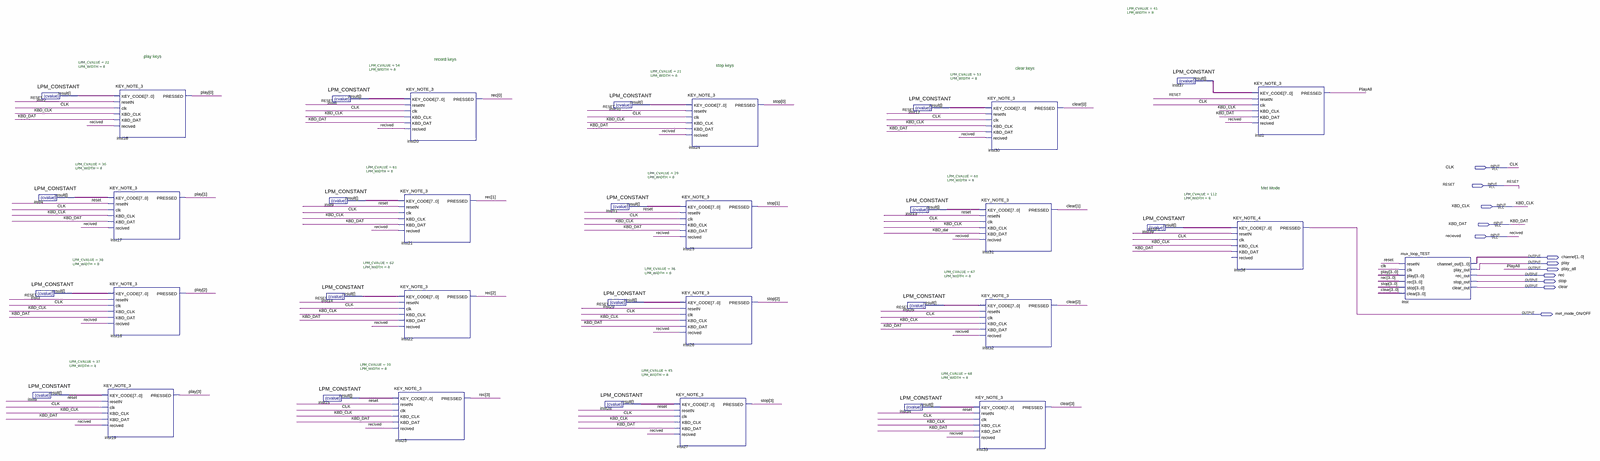
[diagram p0: schematic sheet, whole]
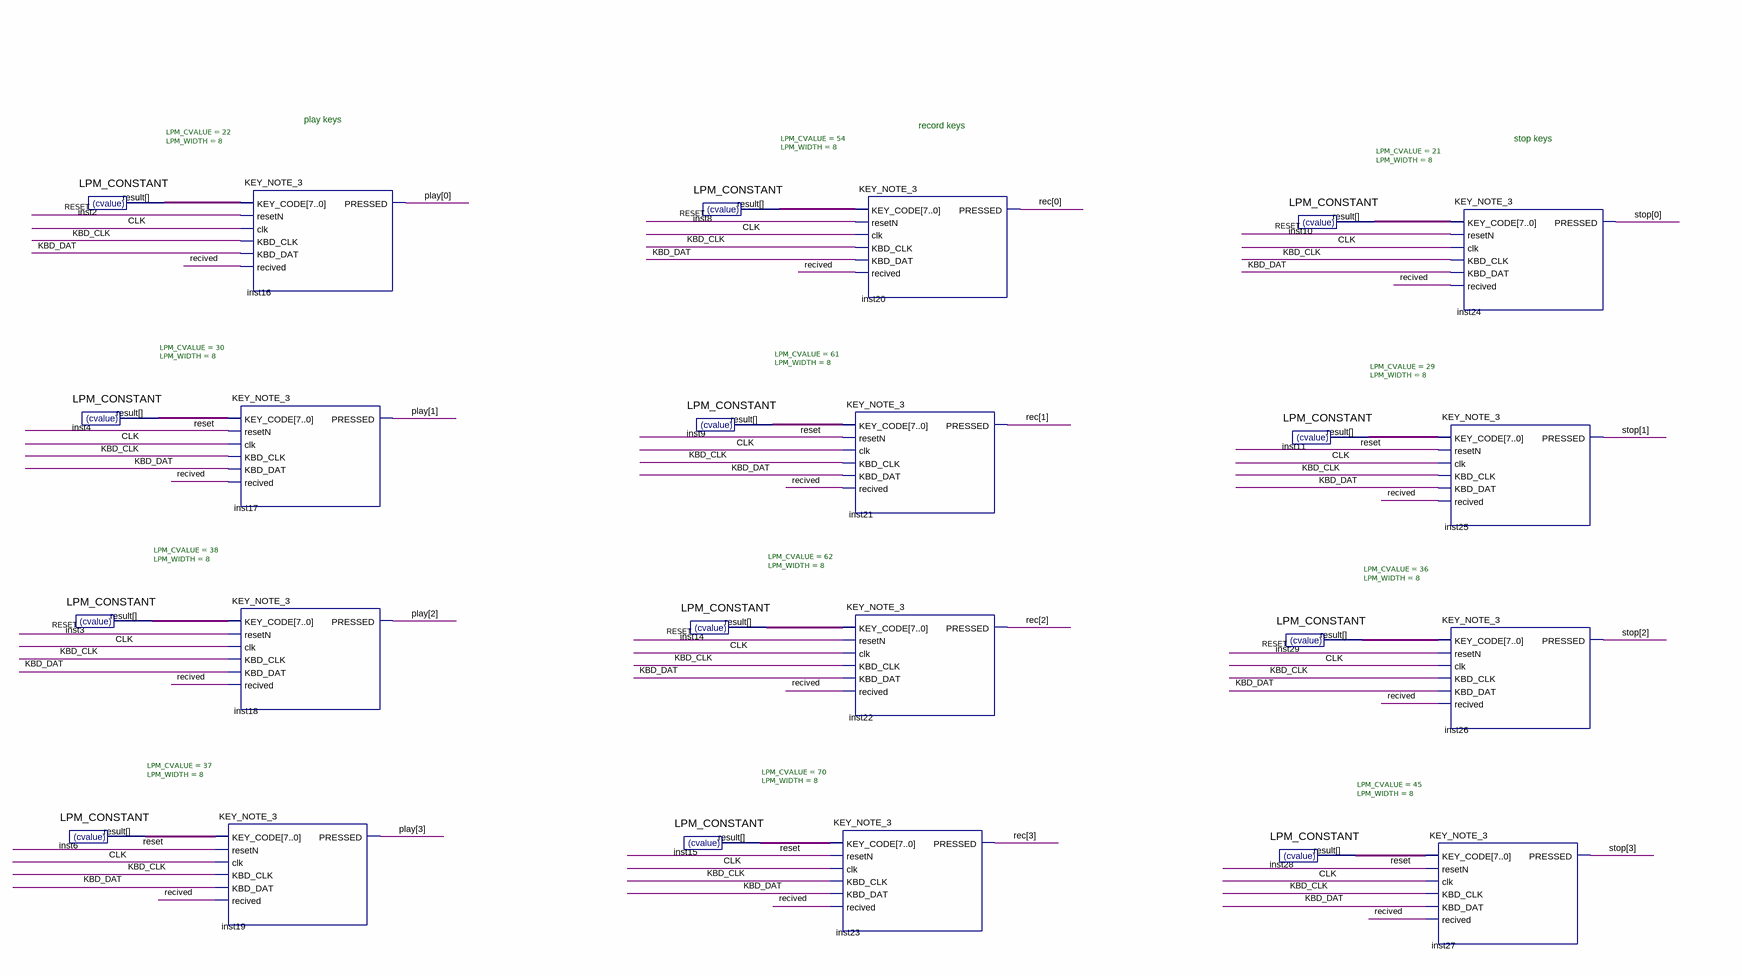
[diagram p1: schematic sheet, left part]
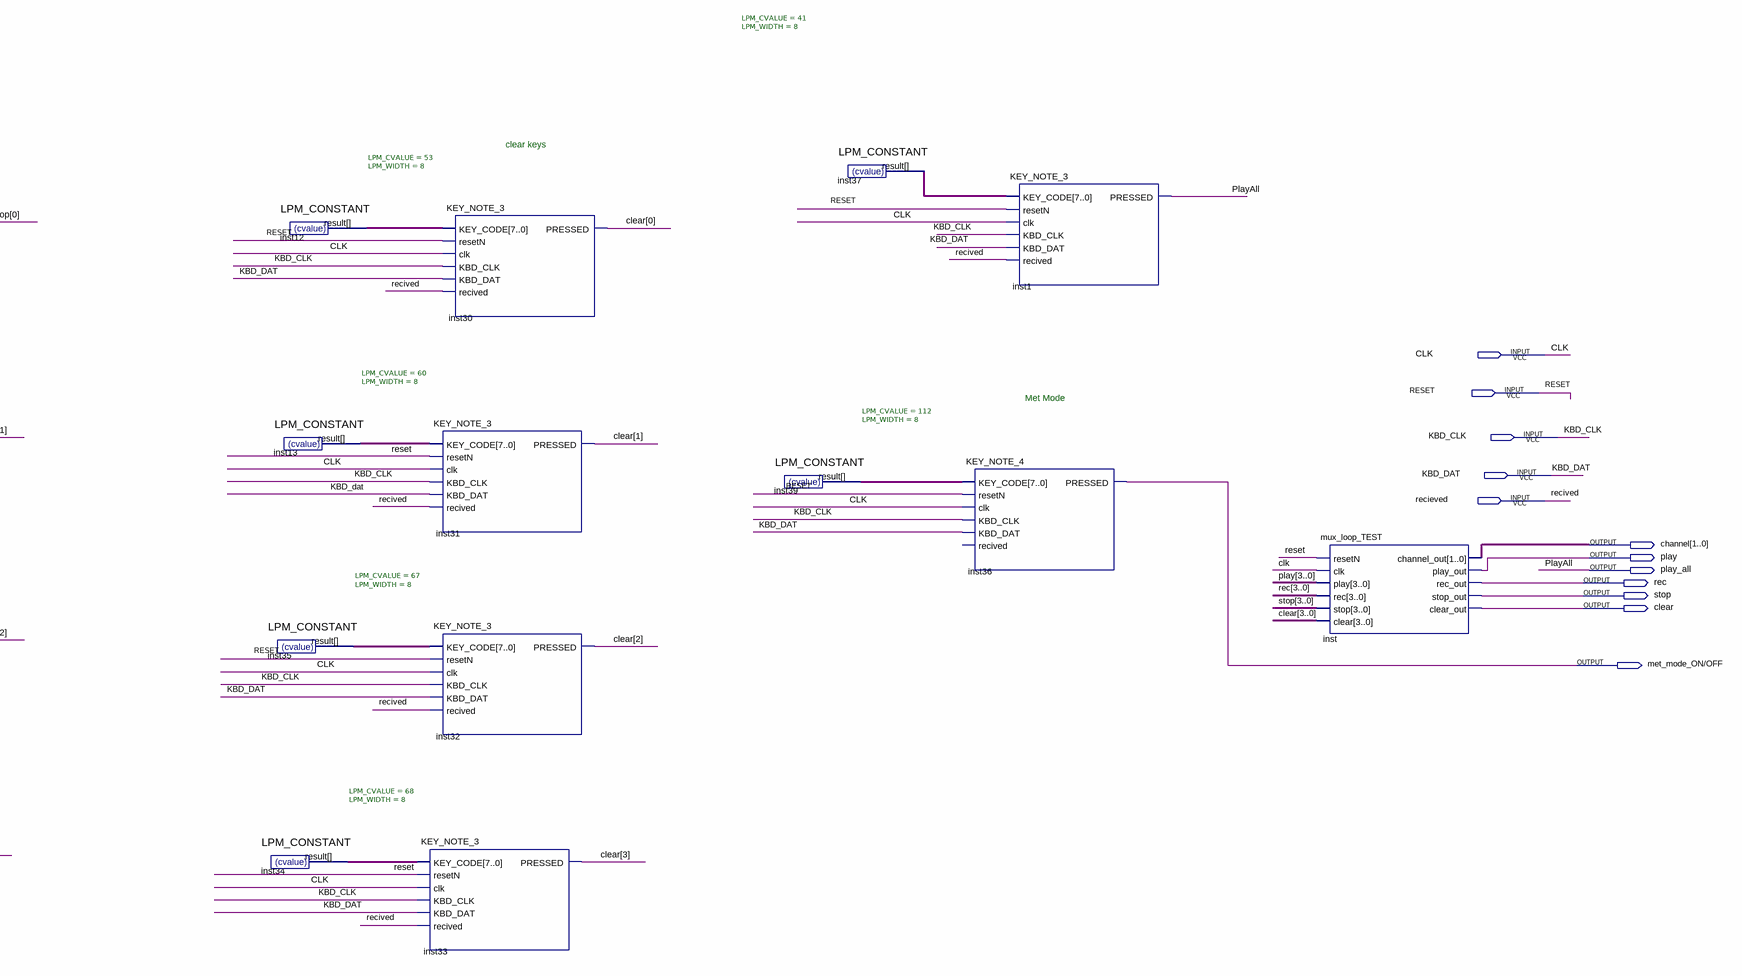
[diagram p2: schematic sheet, right part]
// Quartus schematic KBD_MOD_looper.bdf as structural Verilog: 37 symbols, 12 pins
module KBD_MOD_looper (
  input  CLK,
  input  RESET,
  input  KBD_CLK,
  input  KBD_DAT,
  input  recieved,
  output [1:0] channel,
  output play,
  output play_all,
  output rec,
  output stop,
  output clear,
  output \met_mode_ON/OFF 
);

  wire [3:0] clear_bus, play_bus, rec_bus, stop_bus;
  wire [7:0] inst2_result, inst3_result, inst4_result, inst6_result, inst8_result, inst9_result,
       inst10_result, inst11_result, inst12_result, inst13_result, inst14_result, inst15_result,
       inst28_result, inst29_result, inst34_result, inst35_result, inst37_result, inst39_result;

  LPM_CONSTANT #(.LPM_CVALUE(30), .LPM_WIDTH(8)) inst4 (.result(inst4_result));
  LPM_CONSTANT #(.LPM_CVALUE(38), .LPM_WIDTH(8)) inst3 (.result(inst3_result));
  LPM_CONSTANT #(.LPM_CVALUE(37), .LPM_WIDTH(8)) inst6 (.result(inst6_result));
  LPM_CONSTANT #(.LPM_CVALUE(22), .LPM_WIDTH(8)) inst2 (.result(inst2_result));
  KEY_NOTE_3 inst19 (
    .KEY_CODE(inst6_result), .resetN(RESET), .clk(CLK), .KBD_CLK(KBD_CLK), .KBD_DAT(KBD_DAT),
    .recived(recieved), .PRESSED(play_bus[3]));
  KEY_NOTE_3 inst16 (
    .KEY_CODE(inst2_result), .resetN(RESET), .clk(CLK), .KBD_CLK(KBD_CLK), .KBD_DAT(KBD_DAT),
    .recived(recieved), .PRESSED(play_bus[0]));
  KEY_NOTE_3 inst17 (
    .KEY_CODE(inst4_result), .resetN(RESET), .clk(CLK), .KBD_CLK(KBD_CLK), .KBD_DAT(KBD_DAT),
    .recived(recieved), .PRESSED(play_bus[1]));
  KEY_NOTE_3 inst18 (
    .KEY_CODE(inst3_result), .resetN(RESET), .clk(CLK), .KBD_CLK(KBD_CLK), .KBD_DAT(KBD_DAT),
    .recived(recieved), .PRESSED(play_bus[2]));
  LPM_CONSTANT #(.LPM_CVALUE(62), .LPM_WIDTH(8)) inst14 (.result(inst14_result));
  LPM_CONSTANT #(.LPM_CVALUE(70), .LPM_WIDTH(8)) inst15 (.result(inst15_result));
  LPM_CONSTANT #(.LPM_CVALUE(54), .LPM_WIDTH(8)) inst8 (.result(inst8_result));
  LPM_CONSTANT #(.LPM_CVALUE(61), .LPM_WIDTH(8)) inst9 (.result(inst9_result));
  KEY_NOTE_3 inst23 (
    .KEY_CODE(inst15_result), .resetN(RESET), .clk(CLK), .KBD_CLK(KBD_CLK), .KBD_DAT(KBD_DAT),
    .recived(recieved), .PRESSED(rec_bus[3]));
  KEY_NOTE_3 inst20 (
    .KEY_CODE(inst8_result), .resetN(RESET), .clk(CLK), .KBD_CLK(KBD_CLK), .KBD_DAT(KBD_DAT),
    .recived(recieved), .PRESSED(rec_bus[0]));
  KEY_NOTE_3 inst21 (
    .KEY_CODE(inst9_result), .resetN(RESET), .clk(CLK), .KBD_CLK(KBD_CLK), .KBD_DAT(KBD_DAT),
    .recived(recieved), .PRESSED(rec_bus[1]));
  KEY_NOTE_3 inst22 (
    .KEY_CODE(inst14_result), .resetN(RESET), .clk(CLK), .KBD_CLK(KBD_CLK), .KBD_DAT(KBD_DAT),
    .recived(recieved), .PRESSED(rec_bus[2]));
  LPM_CONSTANT #(.LPM_CVALUE(21), .LPM_WIDTH(8)) inst10 (.result(inst10_result));
  LPM_CONSTANT #(.LPM_CVALUE(29), .LPM_WIDTH(8)) inst11 (.result(inst11_result));
  LPM_CONSTANT #(.LPM_CVALUE(36), .LPM_WIDTH(8)) inst29 (.result(inst29_result));
  LPM_CONSTANT #(.LPM_CVALUE(45), .LPM_WIDTH(8)) inst28 (.result(inst28_result));
  KEY_NOTE_3 inst25 (
    .KEY_CODE(inst11_result), .resetN(RESET), .clk(CLK), .KBD_CLK(KBD_CLK), .KBD_DAT(KBD_DAT),
    .recived(recieved), .PRESSED(stop_bus[1]));
  KEY_NOTE_3 inst26 (
    .KEY_CODE(inst29_result), .resetN(RESET), .clk(CLK), .KBD_CLK(KBD_CLK), .KBD_DAT(KBD_DAT),
    .recived(recieved), .PRESSED(stop_bus[2]));
  KEY_NOTE_3 inst27 (
    .KEY_CODE(inst28_result), .resetN(RESET), .clk(CLK), .KBD_CLK(KBD_CLK), .KBD_DAT(KBD_DAT),
    .recived(recieved), .PRESSED(stop_bus[3]));
  KEY_NOTE_3 inst24 (
    .KEY_CODE(inst10_result), .resetN(RESET), .clk(CLK), .KBD_CLK(KBD_CLK), .KBD_DAT(KBD_DAT),
    .recived(recieved), .PRESSED(stop_bus[0]));
  LPM_CONSTANT #(.LPM_CVALUE(53), .LPM_WIDTH(8)) inst12 (.result(inst12_result));
  LPM_CONSTANT #(.LPM_CVALUE(60), .LPM_WIDTH(8)) inst13 (.result(inst13_result));
  LPM_CONSTANT #(.LPM_CVALUE(67), .LPM_WIDTH(8)) inst35 (.result(inst35_result));
  LPM_CONSTANT #(.LPM_CVALUE(68), .LPM_WIDTH(8)) inst34 (.result(inst34_result));
  KEY_NOTE_3 inst30 (
    .KEY_CODE(inst12_result), .resetN(RESET), .clk(CLK), .KBD_CLK(KBD_CLK), .KBD_DAT(KBD_DAT),
    .recived(recieved), .PRESSED(clear_bus[0]));
  KEY_NOTE_3 inst31 (
    .KEY_CODE(inst13_result), .resetN(RESET), .clk(CLK), .KBD_CLK(KBD_CLK), .KBD_DAT(KBD_DAT),
    .recived(recieved), .PRESSED(clear_bus[1]));
  KEY_NOTE_3 inst32 (
    .KEY_CODE(inst35_result), .resetN(RESET), .clk(CLK), .KBD_CLK(KBD_CLK), .KBD_DAT(KBD_DAT),
    .recived(recieved), .PRESSED(clear_bus[2]));
  KEY_NOTE_3 inst33 (
    .KEY_CODE(inst34_result), .resetN(RESET), .clk(CLK), .KBD_CLK(KBD_CLK), .KBD_DAT(KBD_DAT),
    .recived(recieved), .PRESSED(clear_bus[3]));
  LPM_CONSTANT #(.LPM_CVALUE(112), .LPM_WIDTH(8)) inst39 (.result(inst39_result));
  LPM_CONSTANT #(.LPM_CVALUE(41), .LPM_WIDTH(8)) inst37 (.result(inst37_result));
  KEY_NOTE_4 inst36 (
    .KEY_CODE(inst39_result), .resetN(RESET), .clk(CLK), .KBD_CLK(KBD_CLK), .KBD_DAT(KBD_DAT),
    .PRESSED(\met_mode_ON/OFF ));  // open: recived
  KEY_NOTE_3 inst1 (
    .KEY_CODE(inst37_result), .resetN(RESET), .clk(CLK), .KBD_CLK(KBD_CLK), .KBD_DAT(KBD_DAT),
    .recived(recieved), .PRESSED(play_all));
  mux_loop_TEST inst (
    .resetN(RESET), .clk(CLK), .play(play_bus), .rec(rec_bus), .stop(stop_bus), .clear(clear_bus),
    .channel_out(channel), .play_out(play), .rec_out(rec), .stop_out(stop), .clear_out(clear));

  // Other names for the same wires on the sheet: PlayAll = play_all; recived = recieved

  // Notes on the sheet:
  //   play keys
  //   record keys
  //   stop keys
  //   clear keys
  //   Met Mode
endmodule
